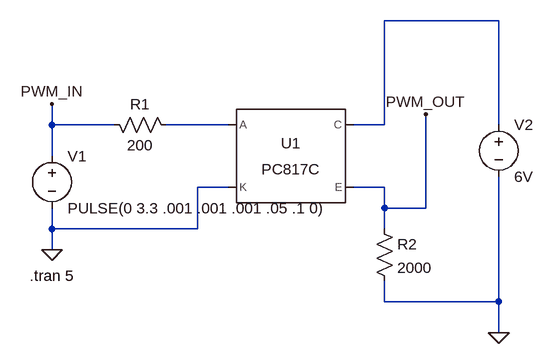
[diagram p0: schematic circuit.asc]
circuit.asc, the LTspice schematic file:
Version 4
SHEET 1 1476 680
WIRE 608 -144 432 -144
WIRE -80 16 -80 -16
WIRE 16 16 -80 16
WIRE 192 16 96 16
WIRE 432 16 432 -144
WIRE 432 16 384 16
WIRE 608 16 608 -144
WIRE -80 64 -80 16
WIRE 192 112 144 112
WIRE 432 112 384 112
WIRE 432 144 432 112
WIRE 496 144 496 0
WIRE 496 144 432 144
WIRE -80 176 -80 144
WIRE 144 176 144 112
WIRE 144 176 -80 176
WIRE 432 176 432 144
WIRE -80 208 -80 176
WIRE 432 288 432 256
WIRE 608 288 608 96
WIRE 608 288 432 288
WIRE 608 336 608 288
FLAG -80 208 0
FLAG 608 336 0
FLAG -80 -16 PWM_IN
FLAG 496 0 PWM_OUT
SYMBOL Optos\\PC817C 288 64 R0
SYMATTR InstName U1
SYMBOL voltage -80 48 R0
WINDOW 123 0 0 Left 0
WINDOW 39 0 0 Left 0
SYMATTR InstName V1
SYMATTR Value PULSE(0 3.3 .001 .001 .001 .05 .1 0)
SYMBOL res 112 32 M270
WINDOW 0 32 56 VTop 2
WINDOW 3 0 56 VBottom 2
SYMATTR InstName R1
SYMATTR Value 200
SYMBOL voltage 608 0 R0
WINDOW 123 0 0 Left 0
WINDOW 39 0 0 Left 0
SYMATTR InstName V2
SYMATTR Value 6V
SYMBOL res 416 160 R0
SYMATTR InstName R2
SYMATTR Value 2000
TEXT -114 248 Left 2 !.tran 5

The netlist it stands for:
* circuit.asc
XU1 N002 0 N001 PWM_OUT PC817 Igain=2.3m  ; PC817C, pins A K C E
V1 PWM_IN 0 PULSE(0 3.3 .001 .001 .001 .05 .1 0)
R1 N002 PWM_IN 200
V2 N001 0 6V
R2 PWM_OUT 0 2000
.tran 5
.lib PC817.sub
.backanno
.end

* Results of the author's LTspice run, read from the files saved beside the schematic
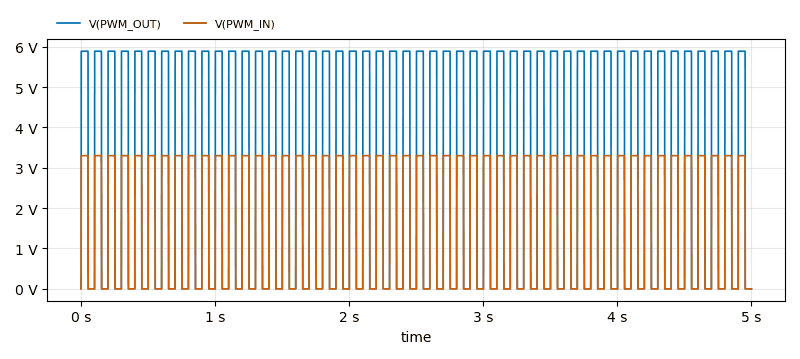
[diagram p1: Transient Analysis of circuit.asc, plotted from the saved traces]
* Transient Analysis, 1 run:
*   V(PWM_OUT): min 0 V, max 5.888 V, average 3.021 V, rms 4.216 V, last 0 V
*   V(PWM_IN): min 0 V, max 3.3 V, average 1.683 V, rms 2.349 V, last 0 V